# EAGLE schematic schematicEagle (EAGLE 9.6.2)
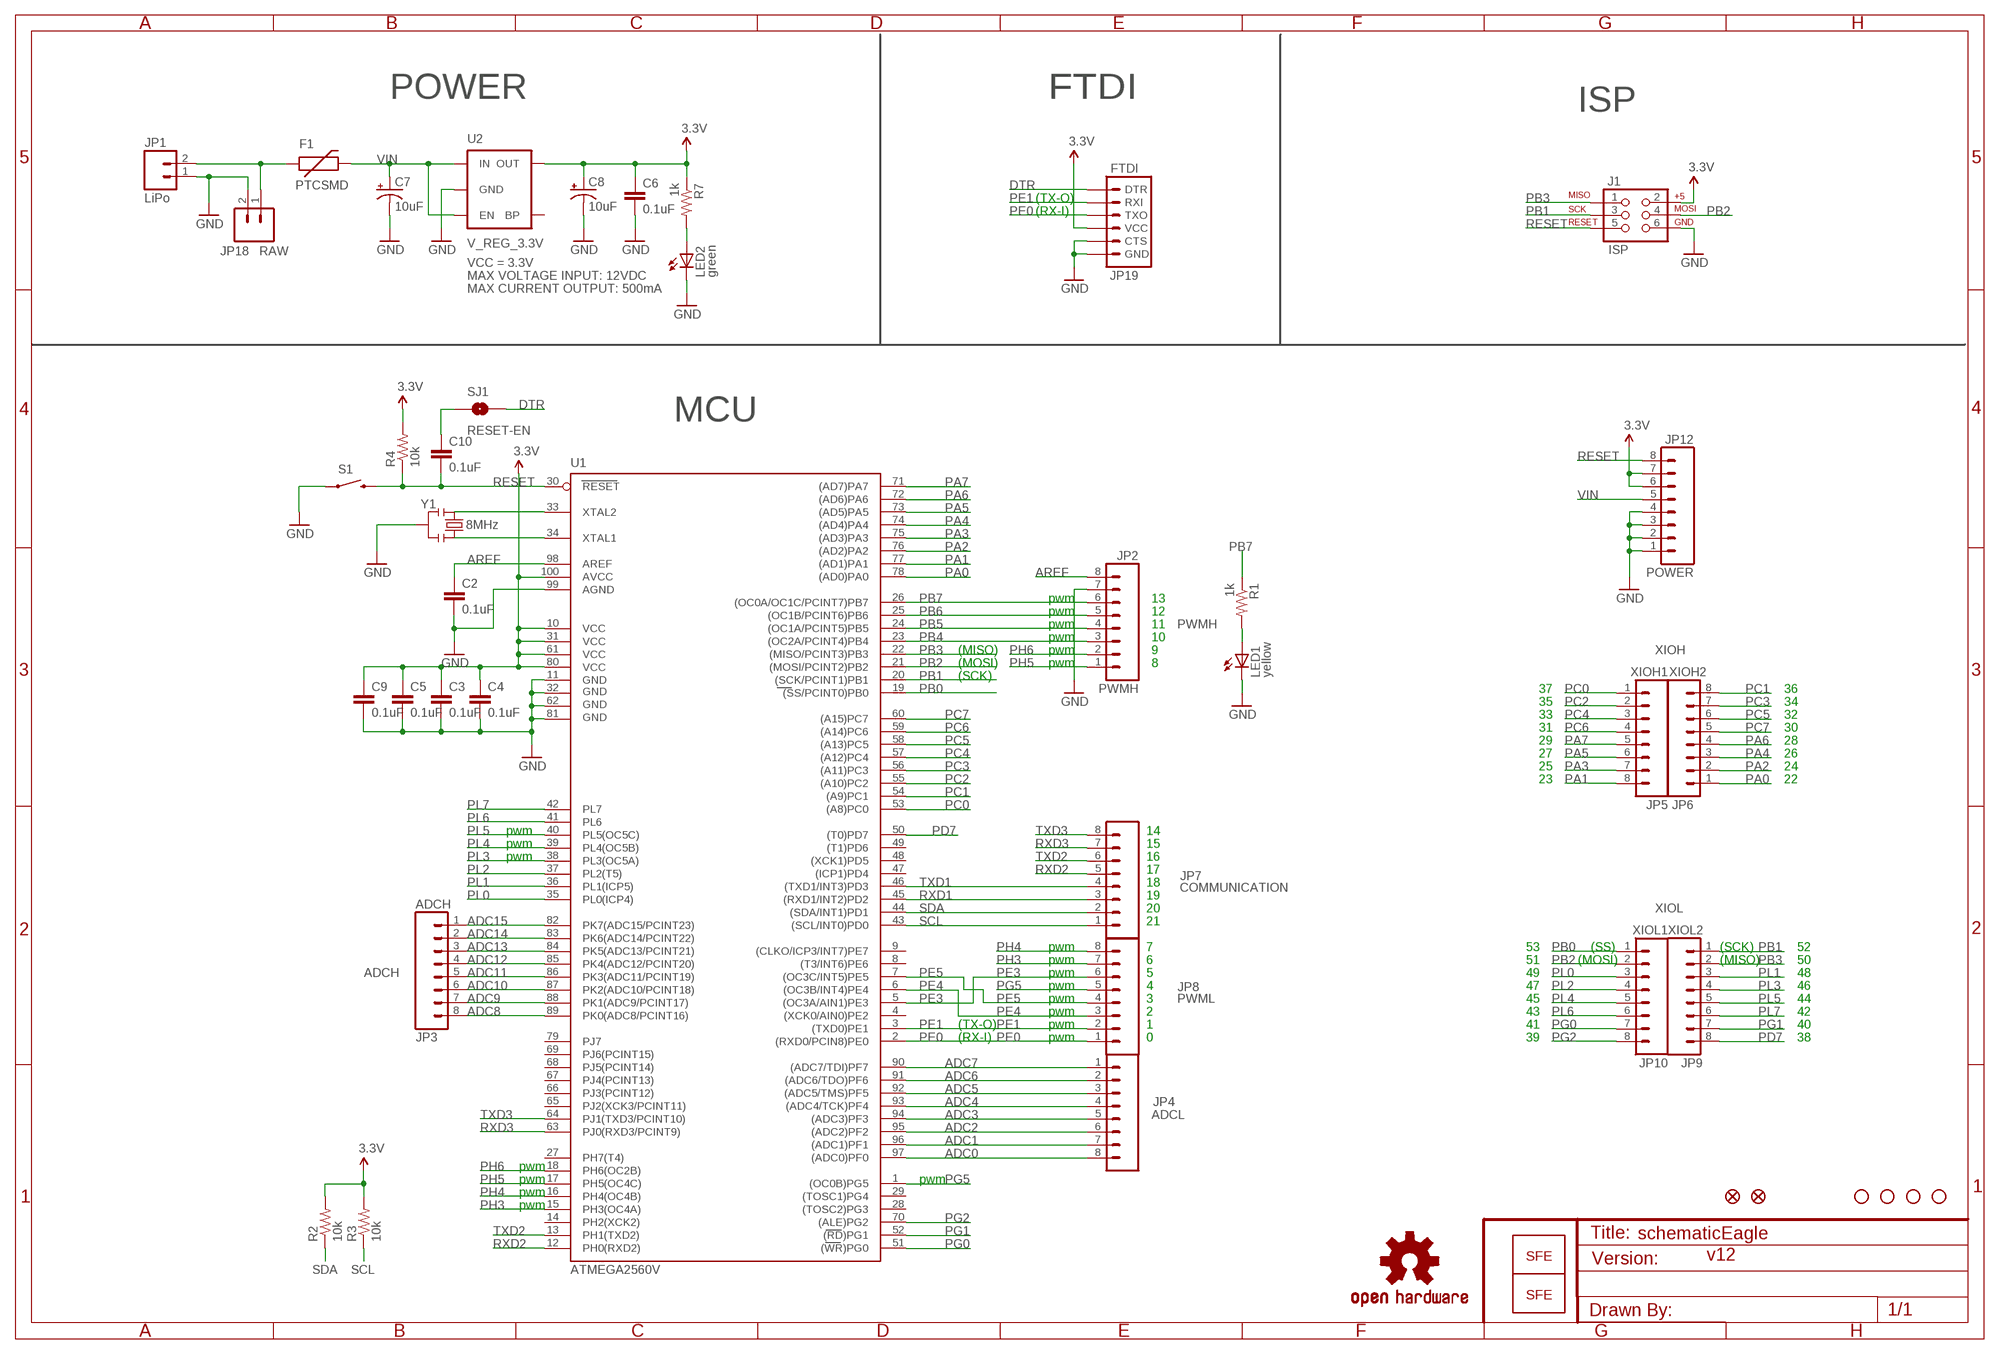
[diagram p0: schematic, sheet 1]

## Parts
C2  0.1uF  CAP0402-CAP  [0402-CAP]
C3  0.1uF  CAP0402-CAP  [0402-CAP]
C4  0.1uF  CAP0402-CAP  [0402-CAP]
C5  0.1uF  CAP0402-CAP  [0402-CAP]
C6  0.1uF  CAP0402-CAP  [0402-CAP]
C7  10uF  CAP_POL1206  [EIA3216]
C8  10uF  CAP_POL1206  [EIA3216]
C9  0.1uF  CAP0402-CAP  [0402-CAP]
C10  0.1uF  CAP0402-CAP  [0402-CAP]
F1  PTCSMD  [PTC-1206]
J1  ISP  AVR_SPI_PRG_6PTH  [2X3]
JP1  LiPo  M02-JST-2MM-SMT  [JST-2-SMD]
JP2  PWMH  M08BM08B-SRSS-TB  [BM08B-SRSS-TB]
JP3  ADCH  M08BM08B-SRSS-TB  [BM08B-SRSS-TB]
JP4  ADCL  M08BM08B-SRSS-TB  [BM08B-SRSS-TB]
JP5  XIOH1  M08BM08B-SRSS-TB  [BM08B-SRSS-TB]
JP6  XIOH2  M08BM08B-SRSS-TB  [BM08B-SRSS-TB]
JP7  COMM  M08BM08B-SRSS-TB  [BM08B-SRSS-TB]
JP8  PWML  M08BM08B-SRSS-TB  [BM08B-SRSS-TB]
JP9  XIOL2  M08BM08B-SRSS-TB  [BM08B-SRSS-TB]
JP10  XIOL1  M08BM08B-SRSS-TB  [BM08B-SRSS-TB]
JP11  STAND-OFF  [STAND-OFF]
JP12  POWER  M08BM08B-SRSS-TB  [BM08B-SRSS-TB]
JP13  STAND-OFF  [STAND-OFF]
JP14  STAND-OFF  [STAND-OFF]
JP15  STAND-OFF  [STAND-OFF]
JP16  LOGO-SFENEW  [SFE-NEW-WEBLOGO]
JP17  LOGO-SFESK  [SFE-LOGO-FLAME]
JP18  RAW  M02PTH  [1X02]
JP19  FTDI  ARDUINO_SERIAL_PROGRAMSMD  [1X06-SMD]
JP20  FIDUCIAL1X2.5  [FIDUCIAL-1X2.5]
JP21  FIDUCIAL1X2.5  [FIDUCIAL-1X2.5]
LED1  yellow  LED0603  [LED-0603]
LED2  green  LED0603  [LED-0603]
R1  1k  RESISTOR0402-RES  [0402-RES]
R2  10k  RESISTOR0402-RES  [0402-RES]
R3  10k  RESISTOR0402-RES  [0402-RES]
R4  10k  RESISTOR0402-RES  [0402-RES]
R7  1k  RESISTOR0402-RES  [0402-RES]
S1  SWITCH-MOMENTARY-2SMD  [TACTILE_SWITCH_SMD]
SJ1  RESET-EN  SOLDERJUMPERNC  [SJ_2S]
U1  ATMEGA2560AU  [TQFP100]
U2  V_REG_3.3V  V_REG_LDOSMD  [SOT23-5]
U$9  OSHW-LOGOL  [OSHW-LOGO-L]
Y1  RESONATORSMD  [RESONATOR-SMD]

## Nets
3.3V: C3.1 C4.1 C5.1 C6.1 C8.A(+) C9.1 J1.2 JP12.6 JP12.7 JP19.4(VCC) R2.2 R3.2 R4.2 R7.1 U1.10(VCC) U1.31(VCC1) U1.61(VCC2) U1.80(VCC3) U1.100(AVCC) U2.5(OUT)
ADC0: JP4.8 U1.97((ADC0)PF0)
ADC1: JP4.7 U1.96((ADC1)PF1)
ADC2: JP4.6 U1.95((ADC2)PF2)
ADC3: JP4.5 U1.94((ADC3)PF3)
ADC4: JP4.4 U1.93((ADC4/TCK)PF4)
ADC5: JP4.3 U1.92((ADC5/TMS)PF5)
ADC6: JP4.2 U1.91((ADC6/TDO)PF6)
ADC7: JP4.1 U1.90((ADC7/TDI)PF7)
ADC8: JP3.8 U1.89(PK0(ADC8/PCINT16))
ADC9: JP3.7 U1.88(PK1(ADC9/PCINT17))
ADC10: JP3.6 U1.87(PK2(ADC10/PCINT18))
ADC11: JP3.5 U1.86(PK3(ADC11/PCINT19))
ADC12: JP3.4 U1.85(PK4(ADC12/PCINT20))
ADC13: JP3.3 U1.84(PK5(ADC13/PCINT21))
ADC14: JP3.2 U1.83(PK6(ADC14/PCINT22))
ADC15: JP3.1 U1.82(PK7(ADC15/PCINT23))
AREF: C2.1 JP2.8 U1.98(AREF)
DTR: JP19.1(DTR) SJ1.2
GND: C2.2 C3.2 C4.2 C5.2 C6.2 C7.C(-) C8.C(-) C9.2 J1.6 JP1.1 JP2.7 JP12.1 JP12.2 JP12.3 JP12.4 JP18.2 JP19.5(CTS) JP19.6(GND) LED1.C LED2.C S1.1 U1.11(GND) U1.32(GND1) U1.62(GND2) U1.81(GND3) U1.99(AGND) U2.2(GND) Y1.2
N$1: F1.1 JP1.2 JP18.1
N$2: LED1.A R1.2
N$4: LED2.A R7.2
N$5: U1.34(XTAL1) Y1.3
N$6: U1.33(XTAL2) Y1.1
N$7: C10.1 SJ1.1
PA0: JP6.1 U1.78((AD0)PA0)
PA1: JP5.8 U1.77((AD1)PA1)
PA2: JP6.2 U1.76((AD2)PA2)
PA3: JP5.7 U1.75((AD3)PA3)
PA4: JP6.3 U1.74((AD4)PA4)
PA5: JP5.6 U1.73((AD5)PA5)
PA6: JP6.4 U1.72((AD6)PA6)
PA7: JP5.5 U1.71((AD7)PA7)
PB0: JP10.1 U1.19((SS/PCINT0)PB0)
PB1: J1.3 JP9.1 U1.20((SCK/PCINT1)PB1)
PB2: J1.4 JP10.2 U1.21((MOSI/PCINT2)PB2)
PB3: J1.1 JP9.2 U1.22((MISO/PCINT3)PB3)
PB4: JP2.3 U1.23((OC2A/PCINT4)PB4)
PB5: JP2.4 U1.24((OC1A/PCINT5)PB5)
PB6: JP2.5 U1.25((OC1B/PCINT6)PB6)
PB7: JP2.6 R1.1 U1.26((OC0A/OC1C/PCINT7)PB7)
PC0: JP5.1 U1.53((A8)PC0)
PC1: JP6.8 U1.54((A9)PC1)
PC2: JP5.2 U1.55((A10)PC2)
PC3: JP6.7 U1.56((A11)PC3)
PC4: JP5.3 U1.57((A12)PC4)
PC5: JP6.6 U1.58((A13)PC5)
PC6: JP5.4 U1.59((A14)PC6)
PC7: JP6.5 U1.60((A15)PC7)
PD7: JP9.8 U1.50((T0)PD7)
PE0: JP8.1 JP19.3(TXO) U1.2((RXD0/PCIN8)PE0)
PE1: JP8.2 JP19.2(RXI) U1.3((TXD0)PE1)
PE3: JP8.6 U1.5((OC3A/AIN1)PE3)
PE4: JP8.3 U1.6((OC3B/INT4)PE4)
PE5: JP8.4 U1.7((OC3C/INT5)PE5)
PG0: JP10.7 U1.51((WR)PG0)
PG1: JP9.7 U1.52((RD)PG1)
PG2: JP10.8 U1.70((ALE)PG2)
PG5: JP8.5 U1.1((OC0B)PG5)
PH3: JP8.7 U1.15(PH3(OC4A))
PH4: JP8.8 U1.16(PH4(OC4B))
PH5: JP2.1 U1.17(PH5(OC4C))
PH6: JP2.2 U1.18(PH6(OC2B))
PL0: JP10.3 U1.35(PL0(ICP4))
PL1: JP9.3 U1.36(PL1(ICP5))
PL2: JP10.4 U1.37(PL2(T5))
PL3: JP9.4 U1.38(PL3(OC5A))
PL4: JP10.5 U1.39(PL4(OC5B))
PL5: JP9.5 U1.40(PL5(OC5C))
PL6: JP10.6 U1.41(PL6)
PL7: JP9.6 U1.42(PL7)
RESET: C10.2 J1.5 JP12.8 R4.1 S1.3 U1.30(RESET)
RXD1: JP7.3 U1.45((RXD1/INT2)PD2)
RXD2: JP7.5 U1.12(PH0(RXD2))
RXD3: JP7.7 U1.63(PJ0(RXD3/PCINT9))
SCL: JP7.1 R3.1 U1.43((SCL/INT0)PD0)
SDA: JP7.2 R2.1 U1.44((SDA/INT1)PD1)
TXD1: JP7.4 U1.46((TXD1/INT3)PD3)
TXD2: JP7.6 U1.13(PH1(TXD2))
TXD3: JP7.8 U1.64(PJ1(TXD3/PCINT10))
VIN: C7.A(+) F1.2 JP12.5 U2.1(IN) U2.3(EN)
Unconnected: U1.4((XCK0/AIN0)PE2) U1.8((T3/INT6)PE6) U1.9((CLKO/ICP3/INT7)PE7) U1.14(PH2(XCK2)) U1.27(PH7(T4)) U1.28((TOSC2)PG3) U1.29((TOSC1)PG4) U1.47((ICP1)PD4) U1.48((XCK1)PD5) U1.49((T1)PD6) U1.65(PJ2(XCK3/PCINT11)) U1.66(PJ3(PCINT12)) U1.67(PJ4(PCINT13)) U1.68(PJ5(PCINT14)) U1.69(PJ6(PCINT15)) U1.79(PJ7) U2.4(BP)

## Notes on the sheet
- POWER | FTDI
- ISP
- (TX-O)
- (RX-I)
- VCC = 3.3V
- MAX VOLTAGE INPUT: 12VDC
- MAX CURRENT OUTPUT: 500mA
- MCU
- 8MHz
- pwm | 13
- pwm | 12
- pwm | 11 | PWMH
- pwm | 10
- (MISO) | pwm | 9 | XIOH
- (MOSI) | pwm | 8
- (SCK)
- 37 | 36
- 35 | 34
- 33 | 32
- 31 | 30
- 29 | 28
- 27 | 26
- 25 | 24
- 23 | 22
- pwm | 14
- pwm | 15
- pwm | 16
- 17
- 18
- COMMUNICATION
- 19
- 20 | XIOL
- 21
- pwm | 7 | 53 | (SS) | (SCK) | 52
- pwm | 6 | 51 | (MOSI) | (MISO) | 50
- ADCH | pwm | 5 | 49 | 48
- pwm | 4 | 47 | 46
- pwm | 3 | PWML | 45 | 44
- pwm | 2 | 43 | 42
- (TX-O) | pwm | 1 | 41 | 40
- (RX-I) | pwm | 0 | 39 | 38
- pwm
- pwm | pwm
- pwm
- pwm
- v12
- ATMEGA2560V

## Library data of the parts
C2-C6 C9 C10 = SparkFun:CAP: Capacitor Standard 0603 ceramic capacitor, and 0.1" leaded capacitor.
C7 C8 = SparkFun:CAP_POL: Capacitor Polarized These are standard SMD and PTH capacitors. Normally 10uF, 47uF, and 100uF in electrolytic and tantalum varieties. Always verify the external diameter of the through hole cap, it varies with capacity, voltage, and manufacturer. The EIA devices should be standard.
F1 = SparkFun:PTC: Resettable Fuse PTC Resettable Fuse. Spark Fun Electronics SKU : COM-08357
J1 = SparkFun:AVR_SPI_PRG_6: AVR ISP 6 Pin This is the reduced ISP connector for AVR programming. Common on Arduino. This footprint will take up less PCB space and can be used with a 10-pin to 6-pin adapter such as SKU: BOB-08508
JP1 JP18 = SparkFun:M02: Header 2 Standard 2-pin 0.1" header. Use with straight break away headers (SKU : PRT-00116), right angle break away headers (PRT-00553), swiss pins (PRT-00743), machine pins (PRT-00117), and female headers (PRT-00115). Molex polarized connector foot print use with SKU : PRT-08233 with associated crimp pins and housings.
JP2-JP10 JP12 = SparkFun:M08: Header 8 Standard 8-pin 0.1" header. Use with straight break away headers (SKU : PRT-00116), right angle break away headers (PRT-00553), swiss pins (PRT-00743), machine pins (PRT-00117), and female headers (PRT-00115).
JP11 JP13-JP15 = SparkFun:STAND-OFF: Stand Off This is the mechanical footprint for a #4 phillips button head screw. Use the keepout ring to avoid running the screw head into surrounding components. SKU : PRT-00447
JP16 JP17 = SparkFun:LOGO-SFE: Spark Fun Electronics PCB Logo This is the standard Spark Fun Electronics PCB logo.
JP19 = SparkFun:ARDUINO_SERIAL_PROGRAM
JP20 JP21 = abes:FIDUCIAL: Fiducial Alignment Points Various fiducial points for machine vision alignment.
LED1 LED2 = SparkFun:LED: LEDs Standard schematic elements and footprints for 5mm, 3mm, 1206, and 0603 sized LEDs. 5mm - Spark Fun Electronics SKU : COM-00529 (and others)
R1-R4 R7 = SparkFun:RESISTOR: Resistor Basic schematic elements and footprints for 0603, 1206, and PTH resistors.
S1 = SparkFun:SWITCH-MOMENTARY-2
SJ1 = SparkFun:SOLDERJUMPER: Solder Jumper Standard SMD solder jumper. Used to automate production. Two varients : Normally Open and Normally Closed are the same, but have different paste layers. NC will have a large amount of paste and should jumper during reflow.
U1 = SparkFun:ATMEGA2560: MICROCONTROLLER 64/128/256 Kbytes FLASH 4 Kbytes EEPROM 8 Kbytes SRAM 86 General Purpose I/O pins 12-channels16-bit PWM 4 x Serial USARTs 16-channels 10-bit A/D
U2 = SparkFun:V_REG_LDO: Voltage Regulator LDO Standard 150mA LDO voltage regulator in SOT-23 layout. Micrel part MIC5205. BP (by-pass) pin is used to lower output noise with 470pF cap.
U$9 = SparkFun:OSHW-LOGO: Open Source Hardware Logo This logo indicates the piece of hardware it is found on incorporates a OSHW license and/or adheres to the definition of open source hardware found here: http://freedomdefined.org/OSHW
Y1 = SparkFun:RESONATOR: Resonator Small SMD resonator. This is the itty bitty 10/20MHz resonators with built in caps. CSTCE10M0G55 and CSTCE20M0V53. Footprint has been reviewed closely but hasn't been tested yet.

## Net classes
0 default: width 0.152 mm, drill 0.305 mm, clearance 0.152 mm